# EasyEDA Pro project w-dmx-schematic.eprj

# Schematic Wireless DMX gateway
Create Date: 2026-05-19; Page Name: P1; Project Name: esp-dmx; Schematic Name: Wireless DMX gateway; Update Date: 2026-05-19; Company: unkernet@gmail.com; Drawn: Unk; Page Size: A5; Version: V1.0
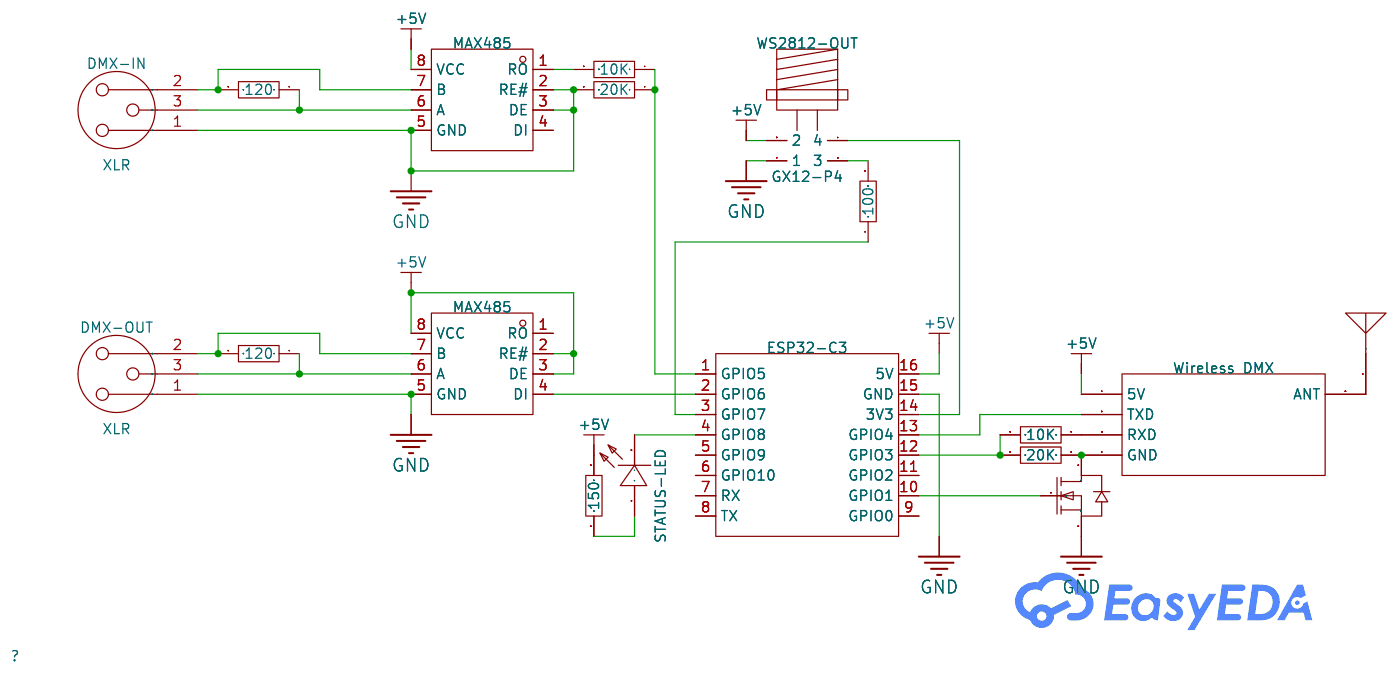
[diagram p0: schematic sheet]

## Parts
DMX-IN  XLR  [CONN-TH_XLR-328]
DMX-OUT  XLR  [CONN-TH_XLR-328]
Q1  IRF530  [TO-220AB-3_L10.4-W4.6-P2.54-L]
R2  10K  [R0603]
R3  20K  [R0603]
R4  120  [R0603]
R5  120  [R0603]
R6  100  [R0603]
R7  150  [R0603]
R8  10K  [R0603]
R9  20K  [R0603]
STATUS-LED  KT-0805Y  [LED0805-R-RD]
U2  MAX485  [SOP-8_L4.9-W3.9-P1.27-LS6.0-BL]
U3  MAX485  [SOP-8_L4.9-W3.9-P1.27-LS6.0-BL]
U4  Wireless DMX
U5  -
U6  ESP32-C3  [COMM-SMD_16P-L22.5-W18.0-P2.54-TL]
WS2812-OUT  GX12-P4  [CONN-TH_GX12C-4P]

## Library data of the parts
DMX-IN DMX-OUT = XLR-328: Supplier Part: C309327; Manufacturer: HOOYA(皓宇电子); JLCPCB Part Class: Extended Part; Datasheet: https://item.szlcsc.com/datasheet/XLR-328/292988.html; Supplier: LCSC; Number of Pins: 3P; Gender: Female; Mounting Type: Right Angle; Current Rating: 3A; Voltage Rating: 50V
Q1 = IRF530: LCSC Part Name: 1个N沟道 耐压:100V 电流:14A; Supplier Part: C3290404; Manufacturer: TI(德州仪器); Supplier Footprint: TO-220AB; JLCPCB Part Class: Extended Part; Supplier: LCSC; Number: One N-channel; Drain to Source Voltage: 600V; Current - Continuous Drain(Id): 14A; RDS(on): 180mΩ@10V,8A; Pd - Power Dissipation: 27W; Gate Threshold Voltage (Vgs(th)): 4V; Input Capacitance(Ciss): 800pF@25V; Operating Temperature: -40℃~+150℃
R2-R9 = Res_0603: Supplier Footprint: 0603
STATUS-LED = KT-0805Y: LCSC Part Name: 0805 黄灯 高亮; Supplier Part: C2296; Manufacturer: KENTO; Supplier Footprint: 0805; JLCPCB Part Class: Basic Part; Datasheet: https://item.szlcsc.com/datasheet/KT-0805Y/2669.html; Supplier: LCSC; Illumination Color: Yellow; Voltage - Forward(Vf): 1.8V~2.4V; Power(Watts): 40mW; Wavelength - Dominant: 584nm~594nm; Peak Wavelength: 596nm; Diode Configuration: Discrete Diode; Lens Color: Water Clear; Luminous Intensity: 175mcd; Viewing Angle: 120°; Operating Temperature: -40℃~+85℃
U2 U3 = MAX485EESA+T(ES): LCSC Part Name: MAX485EESA+T RS-485/RS422收发器; Supplier Part: C41438291; Manufacturer: ElecSuper(静芯微); Supplier Footprint: SOP-8; Datasheet: https://atta.szlcsc.com/upload/public/pdf/source/20241021/BE871474122F591137C5367E5564A964.pdf; Supplier: LCSC; Types: Transceiver; Number of Driver: 1; Number of receiver: 1; Supply Voltage: 4.5V~5.5V; Data Rate: 2.5Mbps; Node Number: 256; ESD Protect: ±15kV; Operating Temperature: -40℃~+125℃
U4 = Wireless DMX
U5 = antenna
U6 = ESP32C3-SuperMini: Supplier Part: C9900147397; Supplier Footprint: SMD-16P; JLCPCB Part Class: Extended Part; Supplier: LCSC
WS2812-OUT = WBC0202-150A: Supplier Part: C9900007560; Supplier Footprint: GX12-C; JLCPCB Part Class: Extended Part; Supplier: LCSC

## Nets
+5V: R7.2 U2.8(VCC) U3.2(RE#) U3.3(DE) U3.8(VCC) U4.4(5V) U6.16(5V) WS2812-OUT.2
GND: DMX-IN.1 DMX-OUT.1 Q1.3(S) R3.2 U2.2(RE#) U2.3(DE) U2.5(GND) U3.5(GND) U6.15(GND) WS2812-OUT.1
Net-(DMX-IN-2): DMX-IN.2 R4.2 U2.7(B)
Net-(DMX-IN-3): DMX-IN.3 R4.1 U2.6(A)
Net-(DMX-OUT-2): DMX-OUT.2 R5.2 U3.7(B)
Net-(DMX-OUT-3): DMX-OUT.3 R5.1 U3.6(A)
Net-(Q1-1): Q1.1(G) U6.10(GPIO1)
Net-(Q1-2): Q1.2(D) R9.1 U4.1(GND)
Net-(R2-1): R2.1 R3.1 U6.1(GPIO5)
Net-(R2-2): R2.2 U2.1(RO)
Net-(R6-1): R6.1 U6.3(GPIO7)
Net-(R6-2): R6.2 WS2812-OUT.3
Net-(R7-1): R7.1 STATUS-LED.1(+)
Net-(R8-1): R8.1 U4.3(RXD)
Net-(R8-2): R8.2 R9.2 U6.12(GPIO3)
Net-(STATUS-LED-2): STATUS-LED.2(-) U6.4(GPIO8)
Net-(U3-4): U3.4(DI) U6.2(GPIO6)
Net-(U4-2): U4.2(TXD) U6.13(GPIO4)
Net-(U4-5): U4.5(ANT) U5.1
Net-(U6-14): U6.14(3V3) WS2812-OUT.4

Not connected (* = marked no-connect by the designer): U2 4(DI); U3 1(RO); U6 5(GPIO9) 6(GPIO10) 7(RX) 8(TX) 9(GPIO0) 11(GPIO2)
